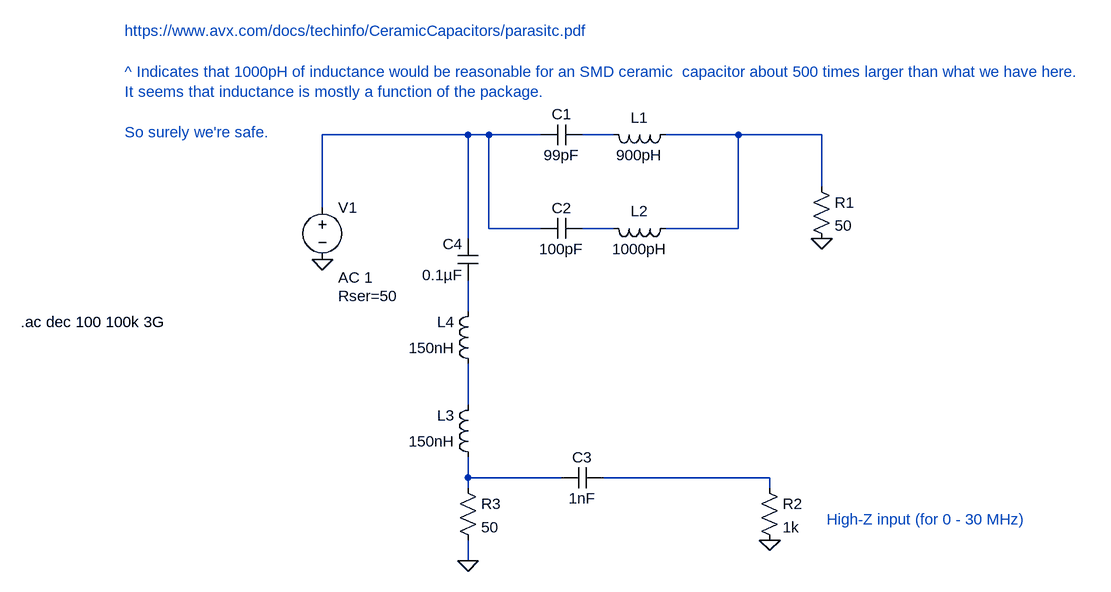
[diagram p0: schematic LNA_coupling.asc]
LNA_coupling.asc, the LTspice schematic file:
Version 4
SHEET 1 1836 756
WIRE 48 80 -176 80
WIRE 80 80 48 80
WIRE 160 80 80 80
WIRE 272 80 224 80
WIRE 464 80 352 80
WIRE 592 80 464 80
WIRE 592 160 592 80
WIRE -176 192 -176 80
WIRE 80 224 80 80
WIRE 160 224 80 224
WIRE 272 224 224 224
WIRE 464 224 464 80
WIRE 464 224 352 224
WIRE 48 240 48 80
WIRE 48 352 48 304
WIRE 48 496 48 432
WIRE 48 608 48 576
WIRE 192 608 48 608
WIRE 512 608 256 608
WIRE 48 624 48 608
WIRE 512 624 512 608
WIRE 48 736 48 704
FLAG -176 272 0
FLAG 592 240 0
FLAG 512 704 0
FLAG 48 736 0
SYMBOL cap 160 96 R270
WINDOW 0 32 32 VTop 2
WINDOW 3 0 32 VBottom 2
SYMATTR InstName C1
SYMATTR Value 99pF
SYMATTR SpiceLine V=25 Irms=0 Rser=0 Lser=0
SYMBOL cap 224 208 R90
WINDOW 0 0 32 VBottom 2
WINDOW 3 32 32 VTop 2
SYMATTR InstName C2
SYMATTR Value 100pF
SYMATTR SpiceLine V=25 Irms=0 Rser=0 Lser=0
SYMBOL res 576 144 R0
SYMATTR InstName R1
SYMATTR Value 50
SYMBOL voltage -176 176 R0
WINDOW 123 24 124 Left 2
WINDOW 39 24 152 Left 2
SYMATTR Value2 AC 1
SYMATTR SpiceLine Rser=50
SYMATTR InstName V1
SYMATTR Value ""
SYMBOL ind 368 64 R90
WINDOW 0 5 56 VBottom 2
WINDOW 3 32 56 VTop 2
SYMATTR InstName L1
SYMATTR Value 900pH
SYMBOL ind 368 208 R90
WINDOW 0 5 56 VBottom 2
WINDOW 3 32 56 VTop 2
SYMATTR InstName L2
SYMATTR Value 1000pH
SYMBOL res 496 608 R0
SYMATTR InstName R2
SYMATTR Value 1k
SYMBOL cap 256 592 R90
WINDOW 0 0 32 VBottom 2
WINDOW 3 32 32 VTop 2
SYMATTR InstName C3
SYMATTR Value 1nF
SYMATTR SpiceLine V=25 Irms=0 Rser=0 Lser=0
SYMBOL ind 64 592 R180
WINDOW 0 36 80 Left 2
WINDOW 3 36 40 Left 2
SYMATTR InstName L3
SYMATTR Value 150nH
SYMATTR SpiceLine Rser=3 Cpar=0.8pF
SYMBOL res 32 608 R0
SYMATTR InstName R3
SYMATTR Value 50
SYMBOL ind 64 448 R180
WINDOW 0 36 80 Left 2
WINDOW 3 36 40 Left 2
SYMATTR InstName L4
SYMATTR Value 150nH
SYMATTR SpiceLine Rser=3 Cpar=0.8pF
SYMBOL cap 64 304 R180
WINDOW 0 24 56 Left 2
WINDOW 3 24 8 Left 2
SYMATTR InstName C4
SYMATTR Value 0.1µF
SYMATTR SpiceLine V=25 Irms=0 Rser=0 Lser=0
TEXT -640 368 Left 2 !.ac dec 100 100k 3G
TEXT -480 -80 Left 2 ;https://www.avx.com/docs/techinfo/CeramicCapacitors/parasitc.pdf\n \n^ Indicates that 1000pH of inductance would be reasonable for an SMD ceramic  capacitor about 500 times larger than what we have here.\nIt seems that inductance is mostly a function of the package.\n \nSo surely we're safe.
TEXT 600 672 Left 2 ;High-Z input (for 0 - 30 MHz)

The netlist it stands for:
* LNA_coupling.asc
C1 N001 N002 99pF V=25 Irms=0 Rser=0 Lser=0
C2 N004 N001 100pF V=25 Irms=0 Rser=0 Lser=0
R1 N003 0 50
V1 N001 0 AC 1 Rser=50
L1 N003 N002 900pH
L2 N003 N004 1000pH
R2 N008 0 1k
C3 N008 N007 1nF V=25 Irms=0 Rser=0 Lser=0
L3 N007 N006 150nH Rser=3 Cpar=0.8pF
R3 N007 0 50
L4 N006 N005 150nH Rser=3 Cpar=0.8pF
C4 N005 N001 0.1µF V=25 Irms=0 Rser=0 Lser=0
.ac dec 100 100k 3G
* https://www.avx.com/docs/techinfo/CeramicCapacitors/parasitc.pdf
* ^ Indicates that 1000pH of inductance would be reasonable for an SMD ceramic  capacitor about 500 times larger than what we have here.
* It seems that inductance is mostly a function of the package.
* So surely we're safe.
* High-Z input (for 0 - 30 MHz)
.backanno
.end